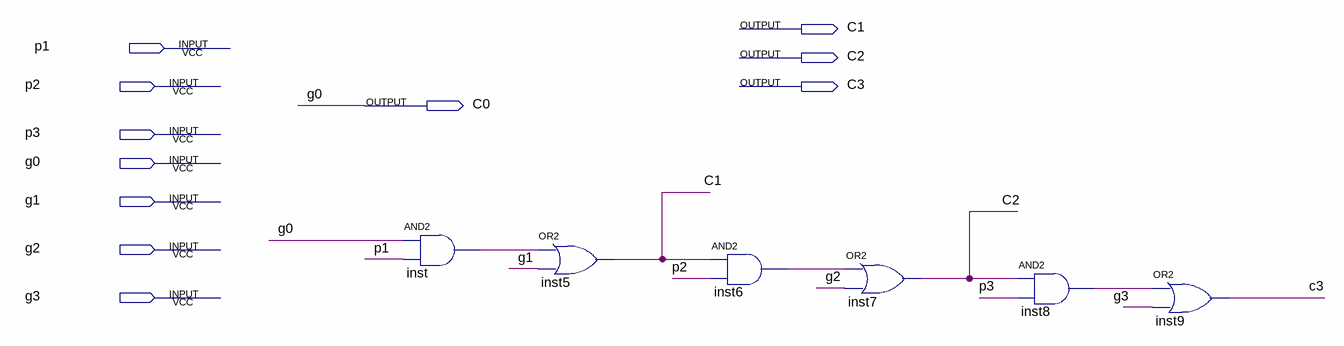
[diagram p0: schematic sheet]
// Quartus schematic 4-bitCarryLookahead.bdf as structural Verilog: 6 symbols, 11 pins
module \4-bitCarryLookahead  (
  input  p1,
  input  p2,
  input  p3,
  input  g0,
  input  g1,
  input  g2,
  input  g3,
  output C1,
  output C2,
  output C3,
  output C0
);

  wire inst6_out, inst8_out, inst_out;

  and inst (inst_out, g0, p1);
  or inst5 (C1, inst_out, g1);
  and inst6 (inst6_out, C1, p2);
  or inst7 (C2, inst6_out, g2);
  and inst8 (inst8_out, C2, p3);
  or inst9 (C3, inst8_out, g3);

  assign C0 = g0;
endmodule
